# Altium schematic sheet cpu_board.SchDoc
size A3
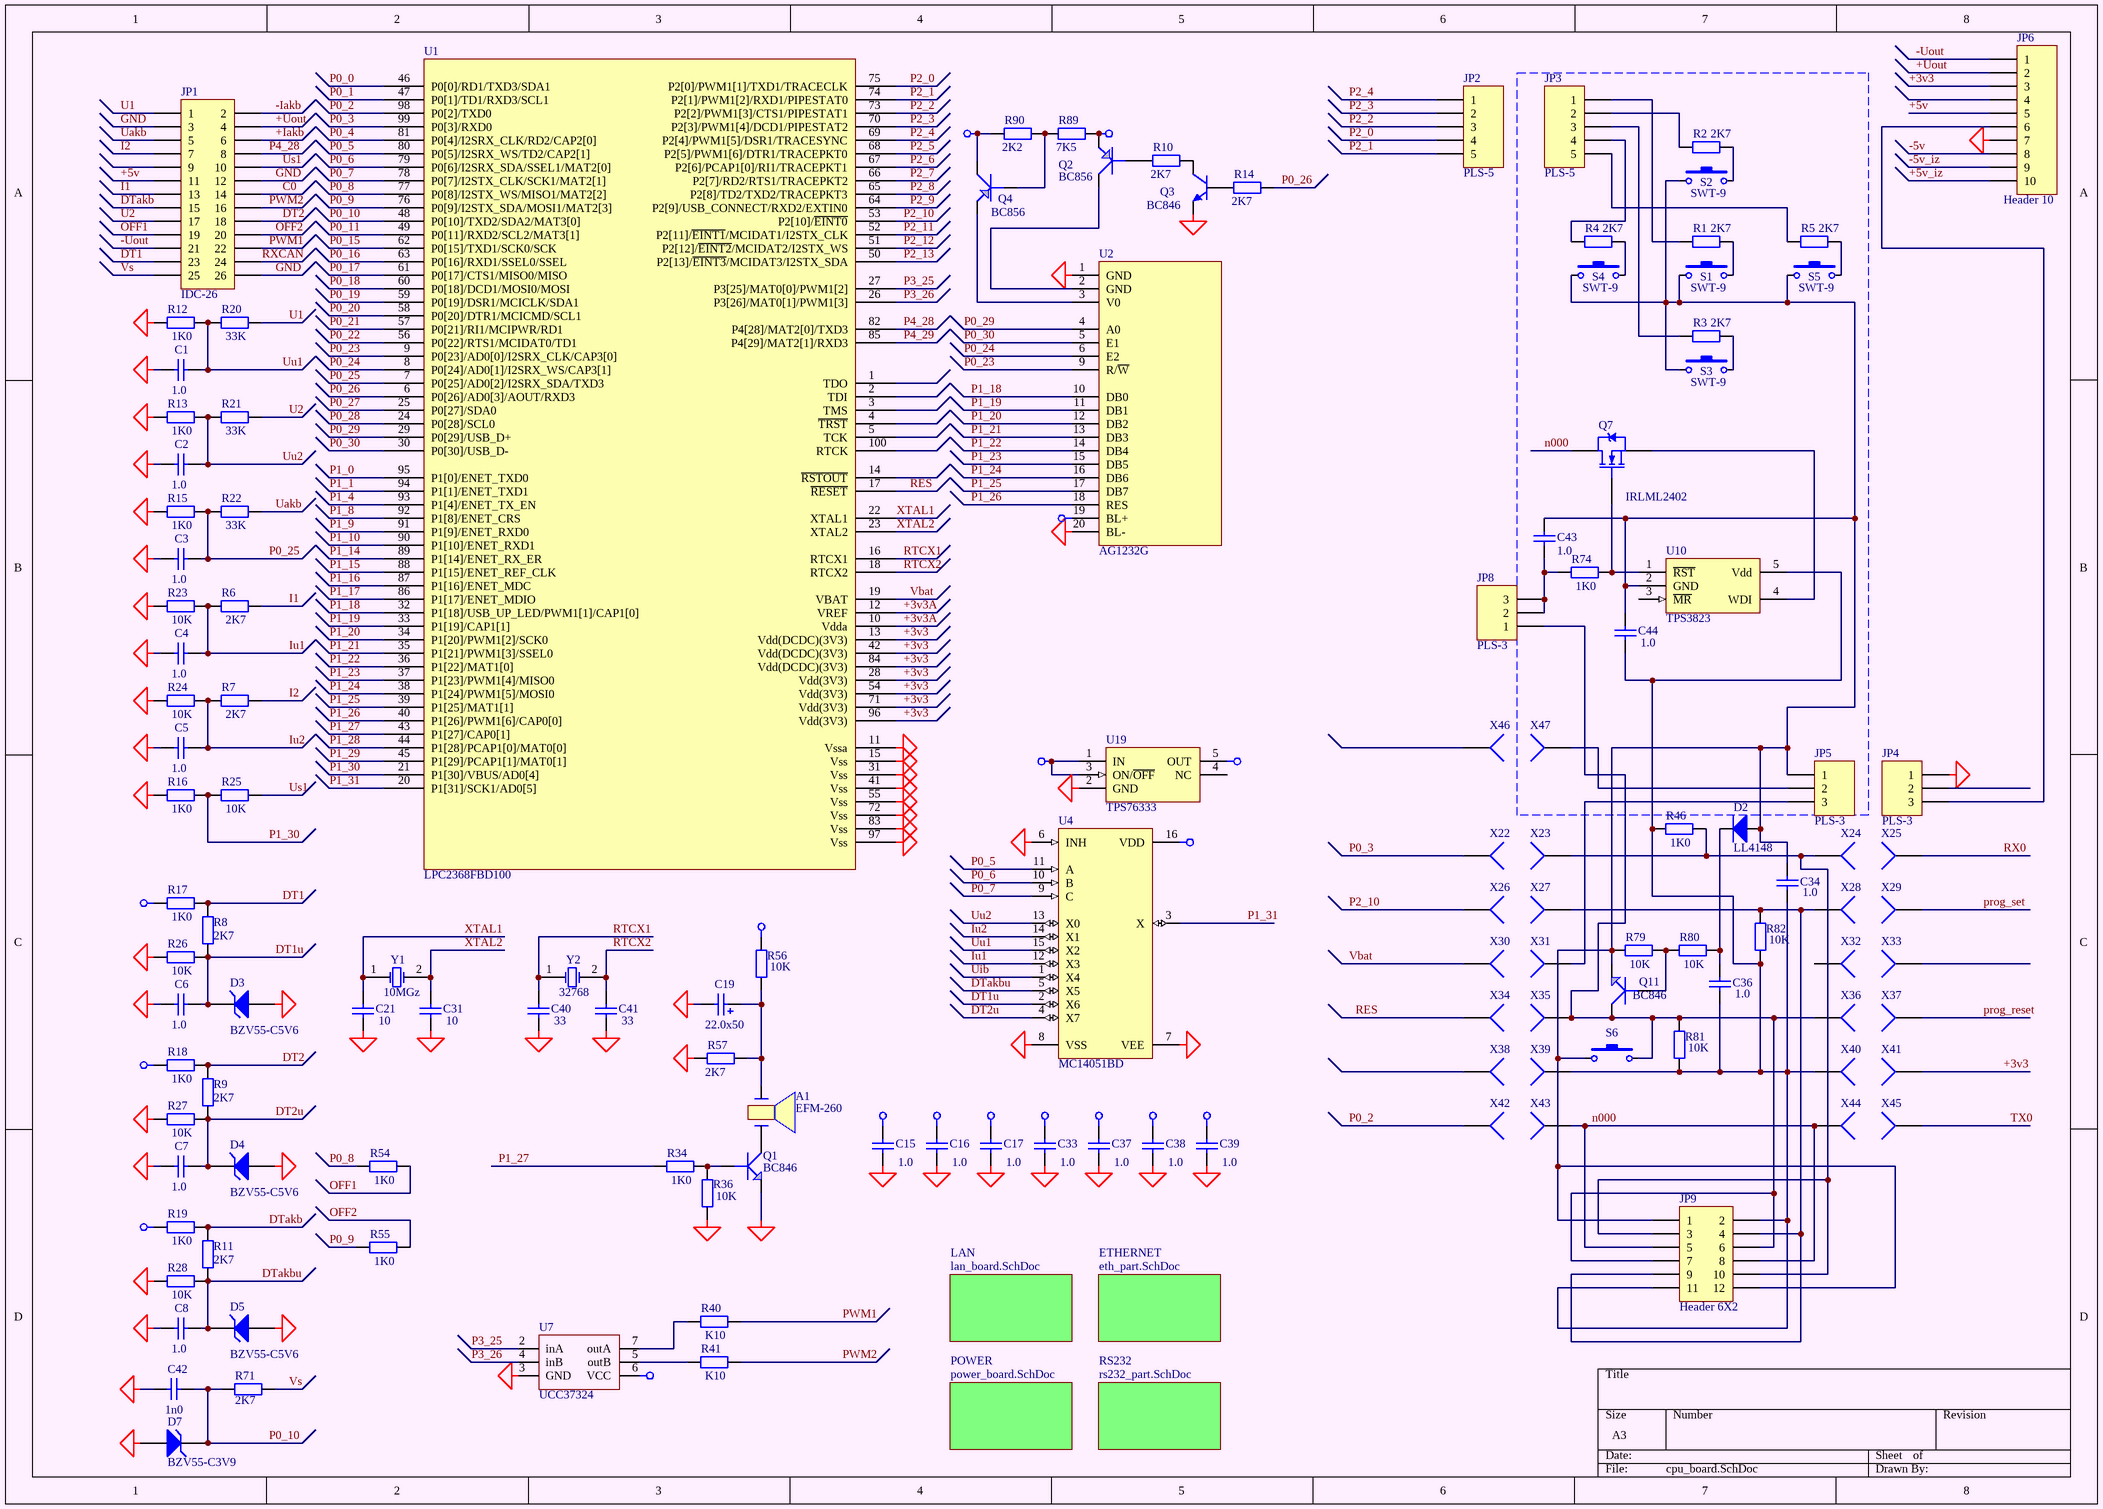
[diagram p0: cpu_board.SchDoc]

## Parts
A1  EFM-260  [Pjezo15]
C1  1.0  [C3216-1206]
C2  1.0  [C3216-1206]
C3  1.0  [C3216-1206]
C4  1.0  [C3216-1206]
C5  1.0  [C3216-1206]
C6  1.0  [C3216-1206]
C7  1.0  [C3216-1206]
C8  1.0  [_1206]
C15  1.0  [C3216-1206]
C16  1.0  [C3216-1206]
C17  1.0  [_1206]
C19  22.0x50  [el3]
C21  10  [_1206]
C31  10  [_1206]
C33  1.0  [_1206]
C34  1.0  [C3216-1206]
C36  1.0  [C3216-1206]
C37  1.0  [_1206]
C38  1.0  [_1206]
C39  1.0  [_1206]
C40  33  [_1206]
C41  33  [_1206]
C42  1n0  [_1206]
C43  1.0  [_1206]
C44  1.0  [_1206]
D2  LL4148  [_1206d]
D3  BZV55-C5V6  [_1206d]
D4  BZV55-C5V6  [_1206d]
D5  BZV55-C5V6  [_1206d]
D7  BZV55-C3V9  [_1206d]
JP1  IDC-26  [SCM-26]
JP2  PLS-5  [HDR1X5]
JP3  PLS-5  [HDR1X5]
JP4  PLS-3  [HDR1X3]
JP5  PLS-3  [HDR1X3]
JP6  Header 10  [HDR2X5]
JP8  PLS-3  [HDR1X3]
JP9  Header 6X2  [sl-12mini]
Q1  BC846  [SO-G3]
Q2  BC856  [SO-G3]
Q3  BC846  [SO-G3]
Q4  BC856  [SO-G3]
Q7  IRLML2402  [SO-G3]
Q11  BC846  [SO-G3]
R1  2K7  [_1206]
R2  2K7  [_1206]
R3  2K7  [_1206]
R4  2K7  [_1206]
R5  2K7  [_1206]
R6  2K7  [_1206]
R7  2K7  [_1206]
R8  2K7  [_1206]
R9  2K7  [_1206]
R10  2K7  [_1206]
R11  2K7  [_1206]
R12  1K0  [_1206]
R13  1K0  [_1206]
R14  2K7  [_1206]
R15  1K0  [_1206]
R16  1K0  [_1206]
R17  1K0  [_1206]
R18  1K0  [_1206]
R19  1K0  [_1206]
R20  33K  [_1206]
R21  33K  [_1206]
R22  33K  [_1206]
R23  10K  [_1206]
R24  10K  [_1206]
R25  10K  [_1206]
R26  10K  [_1206]
R27  10K  [_1206]
R28  10K  [_1206]
R34  1K0  [_1206]
R36  10K  [_1206]
R40  K10  [_1206]
R41  K10  [_1206]
R46  1K0  [_1206]
R54  1K0  [_1206]
R55  1K0  [_1206]
R56  10K  [_1206]
R57  2K7  [_1206]
R71  2K7  [_1206]
R74  1K0  [_1206]
R79  10K  [_1206]
R80  10K  [_1206]
R81  10K  [_1206]
R82  10K  [_1206]
R89  7K5  [_1206]
R90  2K2  [_1206]
S1  SWT-9  [SWT-9]
S2  SWT-9  [SWT-9]
S3  SWT-9  [SWT-9]
S4  SWT-9  [SWT-9]
S5  SWT-9  [SWT-9]
S6  SWT-6  [SWT-6]  (value not drawn)
U1  LPC2368FBD100  [LPC2368]
U2  AG1232G  [AG1232G]
U4  MC14051BD  [SO-G16/C5.85]
U7  UCC37324  [SO-G8]
U10  TPS3823  [SO-G5/P.95]
U19  TPS76333  [SO-G5/P.95]
X22  (no value)  [PIN1]
X23  (no value)  [PIN1]
X24  (no value)  [PIN1]
X25  (no value)  [PIN1]
X26  (no value)  [PIN1]
X27  (no value)  [PIN1]
X28  (no value)  [PIN1]
X29  (no value)  [PIN1]
X30  (no value)  [PIN1]
X31  (no value)  [PIN1]
X32  (no value)  [PIN1]
X33  (no value)  [PIN1]
X34  (no value)  [PIN1]
X35  (no value)  [PIN1]
X36  (no value)  [PIN1]
X37  (no value)  [PIN1]
X38  (no value)  [PIN1]
X39  (no value)  [PIN1]
X40  (no value)  [PIN1]
X41  (no value)  [PIN1]
X42  (no value)  [PIN1]
X43  (no value)  [PIN1]
X44  (no value)  [PIN1]
X45  (no value)  [PIN1]
X46  (no value)  [PIN1]
X47  (no value)  [PIN1]
Y1  10MGz  [QWARZ1]
Y2  32768  [QWARZ2]

## Sub-sheets
ETHERNET = eth_part.SchDoc: no entries
LAN = lan_board.SchDoc: no entries
POWER = power_board.SchDoc: no entries
RS232 = rs232_part.SchDoc: no entries

## Nets
+3v3: C37.2 C38.2 C39.2 JP6.3 U1.13(Vdd(DCDC)(3V3)) U1.28(Vdd(3V3)) U1.42(Vdd(DCDC)(3V3)) U1.54(Vdd(3V3)) U1.71(Vdd(3V3)) U1.84(Vdd(DCDC)(3V3)) U1.96(Vdd(3V3)) U4.16(VDD) X41.1
+3v3A: C17.2 C33.2 U1.10(Vdda) U1.12(VREF) U19.5(OUT)
+5v: C15.2 JP1.11 JP6.5 Q2.2(E) R17.2 R18.2 R19.2 R89.2 U2.19(BL+) U7.6(VCC) U19.1(IN) U19.3(ON/~{OFF})
+Uout: JP1.4 JP6.2 R56.2
-5v: C16.2 JP6.8 Q4.3(C) R90.1
GND: C1.2 C2.2 C3.2 C4.2 C5.2 C6.2 C7.2 C8.2 C15.1 C16.1 C17.1 C19.2 C21.1 C31.1 C33.1 C37.1 C38.1 C39.1 C40.1 C41.1 C42.2 D3.1(A) D4.1(A) D5.1(A) D7.1(A) JP1.3 JP1.12 JP1.26 JP4.1 JP6.7 Q1.2(E) Q3.2(E) R12.2 R13.2 R15.2 R16.2 R23.1 R24.1 R26.1 R27.1 R28.1 R36.1 R57.1 U1.11(Vssa) U1.15(Vss) U1.31(Vss) U1.41(Vss) U1.55(Vss) U1.72(Vss) U1.83(Vss) U1.97(Vss) U2.1(GND) U2.20(BL-) U4.6(INH) U4.7(VEE) U4.8(VSS) U7.3(GND) U19.2(GND)
+5v_iz: JP6.10
+Iakb: JP1.6
-5v_iz: JP6.9
-Iakb: JP1.2
-Uout: JP1.21 JP6.1
C0: JP1.14
DT1: JP1.23 R8.2 R17.1
DT1u: C6.1 D3.2(K) R8.1 R26.2 U4.2(X6)
DT2: JP1.18 R9.2 R18.1
DT2u: C7.1 D4.2(K) R9.1 R27.2 U4.4(X7)
DTakb: JP1.15 R11.2 R19.1
DTakbu: C8.1 D5.2(K) R11.1 R28.2 U4.5(X5)
I1: JP1.13 R6.2
I2: JP1.7 R7.2
Iu1: C4.1 R6.1 R23.2 U4.12(X3)
Iu2: C5.1 R7.1 R24.2 U4.14(X1)
n000: JP9.5 JP9.8 Q7.3(D) X43.1 X44.1
OFF1: JP1.19 R54.2
OFF2: JP1.20 R55.2
P0_0: U1.46(P0[0]/RD1/TXD3/SDA1)
P0_1: U1.47(P0[1]/TD1/RXD3/SCL1)
P0_2: U1.98(P0[2]/TXD0) X42.1
P0_3: U1.99(P0[3]/RXD0) X22.1
P0_4: U1.81(P0[4]/I2SRX_CLK/RD2/CAP2[0])
P0_5: U1.80(P0[5]/I2SRX_WS/TD2/CAP2[1]) U4.11(A)
P0_6: U1.79(P0[6]/I2SRX_SDA/SSEL1/MAT2[0]) U4.10(B)
P0_7: U1.78(P0[7]/I2STX_CLK/SCK1/MAT2[1]) U4.9(C)
P0_8: R54.1 U1.77(P0[8]/I2STX_WS/MISO1/MAT2[2])
P0_9: R55.1 U1.76(P0[9]/I2STX_SDA/MOSI1/MAT2[3])
P0_10: C42.1 D7.2(K) R71.2 U1.48(P0[10]/TXD2/SDA2/MAT3[0])
P0_11: U1.49(P0[11]/RXD2/SCL2/MAT3[1])
P0_15: U1.62(P0[15]/TXD1/SCK0/SCK)
P0_16: U1.63(P0[16]/RXD1/SSEL0/SSEL)
P0_17: U1.61(P0[17]/CTS1/MISO0/MISO)
P0_18: U1.60(P0[18]/DCD1/MOSI0/MOSI)
P0_19: U1.59(P0[19]/DSR1/MCICLK/SDA1)
P0_20: U1.58(P0[20]/DTR1/MCICMD/SCL1)
P0_21: U1.57(P0[21]/RI1/MCIPWR/RD1)
P0_22: U1.56(P0[22]/RTS1/MCIDAT0/TD1)
P0_23: U1.9(P0[23]/AD0[0]/I2SRX_CLK/CAP3[0]) U2.9(R/~{W})
P0_24: U1.8(P0[24]/AD0[1]/I2SRX_WS/CAP3[1]) U2.6(E2)
P0_25: C3.1 R15.1 R22.1 U1.7(P0[25]/AD0[2]/I2SRX_SDA/TXD3)
P0_26: R14.1 U1.6(P0[26]/AD0[3]/AOUT/RXD3)
P0_27: U1.25(P0[27]/SDA0)
P0_28: U1.24(P0[28]/SCL0)
P0_29: U1.29(P0[29]/USB_D+) U2.4(A0)
P0_30: U1.30(P0[30]/USB_D-) U2.5(E1)
P1_0: U1.95(P1[0]/ENET_TXD0)
P1_1: U1.94(P1[1]/ENET_TXD1)
P1_4: U1.93(P1[4]/ENET_TX_EN)
P1_8: U1.92(P1[8]/ENET_CRS)
P1_9: U1.91(P1[9]/ENET_RXD0)
P1_10: U1.90(P1[10]/ENET_RXD1)
P1_14: U1.89(P1[14]/ENET_RX_ER)
P1_15: U1.88(P1[15]/ENET_REF_CLK)
P1_16: U1.87(P1[16]/ENET_MDC)
P1_17: U1.86(P1[17]/ENET_MDIO)
P1_18: U1.32(P1[18]/USB_UP_LED/PWM1[1]/CAP1[0]) U2.10(DB0)
P1_19: U1.33(P1[19]/CAP1[1]) U2.11(DB1)
P1_20: U1.34(P1[20]/PWM1[2]/SCK0) U2.12(DB2)
P1_21: U1.35(P1[21]/PWM1[3]/SSEL0) U2.13(DB3)
P1_22: U1.36(P1[22]/MAT1[0]) U2.14(DB4)
P1_23: U1.37(P1[23]/PWM1[4]/MISO0) U2.15(DB5)
P1_24: U1.38(P1[24]/PWM1[5]/MOSI0) U2.16(DB6)
P1_25: U1.39(P1[25]/MAT1[1]) U2.17(DB7)
P1_26: U1.40(P1[26]/PWM1[6]/CAP0[0]) U2.18(RES)
P1_27: R34.1 U1.43(P1[27]/CAP0[1])
P1_28: U1.44(P1[28]/PCAP1[0]/MAT0[0])
P1_29: U1.45(P1[29]/PCAP1[1]/MAT0[1])
P1_30: R16.1 R25.1 U1.21(P1[30]/VBUS/AD0[4])
P1_31: U1.20(P1[31]/SCK1/AD0[5]) U4.3(X)
P2_0: JP2.4 U1.75(P2[0]/PWM1[1]/TXD1/TRACECLK)
P2_1: JP2.5 U1.74(P2[1]/PWM1[2]/RXD1/PIPESTAT0)
P2_2: JP2.3 U1.73(P2[2]/PWM1[3]/CTS1/PIPESTAT1)
P2_3: JP2.2 U1.70(P2[3]/PWM1[4]/DCD1/PIPESTAT2)
P2_4: JP2.1 U1.69(P2[4]/PWM1[5]/DSR1/TRACESYNC)
P2_5: U1.68(P2[5]/PWM1[6]/DTR1/TRACEPKT0)
P2_6: U1.67(P2[6]/PCAP1[0]/RI1/TRACEPKT1)
P2_7: U1.66(P2[7]/RD2/RTS1/TRACEPKT2)
P2_8: U1.65(P2[8]/TD2/TXD2/TRACEPKT3)
P2_9: U1.64(P2[9]/USB_CONNECT/RXD2/EXTIN0)
P2_10: U1.53(P2[10]/~{EINT0}) X26.1
P2_11: U1.52(P2[11]/~{EINT1}/MCIDAT1/I2STX_CLK)
P2_12: U1.51(P2[12]/~{EINT2}/MCIDAT2/I2STX_WS)
P2_13: U1.50(P2[13]/~{EINT3}/MCIDAT3/I2STX_SDA)
P3_25: U1.27(P3[25]/MAT0[0]/PWM1[2]) U7.2(inA)
P3_26: U1.26(P3[26]/MAT0[1]/PWM1[3]) U7.4(inB)
P4_28: JP1.8 U1.82(P4[28]/MAT2[0]/TXD3)
P4_29: U1.85(P4[29]/MAT2[1]/RXD3)
prog_reset: X37.1
prog_set: X29.1
PWM1: JP1.22 R40.1
PWM2: JP1.16 R41.1
RES: U1.17(~{RESET}) X34.1
RTCX1: C40.2 U1.16(RTCX1) Y2.1(OSC1)
RTCX2: C41.2 U1.18(RTCX2) Y2.2(OSC2)
RX0: X25.1
RXCAN: JP1.24
TX0: X45.1
U1: JP1.1 R20.2
U2: JP1.17 R21.2
Uakb: JP1.5 R22.2
Uib: U4.1(X4)
Us1: JP1.10 R25.2
Uu1: C1.1 R12.1 R20.1 U4.15(X2)
Uu2: C2.1 R13.1 R21.1 U4.13(X0)
Vbat: U1.19(VBAT) X30.1
Vs: JP1.25 R71.1
XTAL1: C21.2 U1.22(XTAL1) Y1.1(OSC1)
XTAL2: C31.2 U1.23(XTAL2) Y1.2(OSC2)
NetA1_1: A1.1 Q1.3(C)
NetA1_2: A1.2 C19.1 R56.1 R57.2
NetC34_1: C34.1 C43.1 C44.2 D2.1(A) JP5.1 JP9.1 JP9.12 Q11.2(E) R79.1 S1.1 S2.1 S3.1 S4.1 S5.1 S6.1 U10.2(GND)
NetC34_2: C34.2 C36.2 C44.1 JP9.2 JP9.11 R46.2 R81.1 R82.1 U10.5(Vdd) X39.1 X40.1
NetC36_1: C36.1 D2.2(K) R80.2
NetC43_2: C43.2 JP8.2 JP8.3 R74.2
NetJP3_1: JP3.1 R1.2
NetJP3_2: JP3.2 R2.2
NetJP3_3: JP3.3 R3.2
NetJP3_4: JP3.4 R4.2
NetJP3_5: JP3.5 R5.2
NetJP4_3: JP4.3 JP6.6
NetJP5_2: JP5.2 X47.1
NetJP5_3: JP5.3 X31.1
NetJP8_1: JP8.1 JP9.6 JP9.7 Q11.3(C) R81.2 S6.2 X35.1 X36.1
NetJP9_3: JP9.3 JP9.10 R46.1 X23.1 X24.1
NetJP9_4: JP9.4 JP9.9 R82.2 X27.1 X28.1
NetQ1_1: Q1.1(B) R34.2 R36.2
NetQ2_1: Q2.1(B) R10.2
NetQ2_3: Q2.3(C) U2.2(GND)
NetQ3_1: Q3.1(B) R14.2
NetQ3_3: Q3.3(C) R10.1
NetQ4_1: Q4.1(B) R89.1 R90.2
NetQ4_2: Q4.2(E) U2.3(V0)
NetQ7_1: Q7.1(G) R74.1 U10.1(~{RST})
NetQ7_2: Q7.2(S) U10.4(WDI)
NetQ11_1: Q11.1(B) R79.2 R80.1
NetR1_1: R1.1 S1.2
NetR2_1: R2.1 S2.2
NetR3_1: R3.1 S3.2
NetR4_1: R4.1 S4.2
NetR5_1: R5.1 S5.2
NetR40_2: R40.2 U7.7(outA)
NetR41_2: R41.2 U7.5(outB)

Not connected (* = marked no-connect by the designer): JP1 9; JP4 2; JP6 4; U1 1(TDO) 2(TDI) 3(TMS) 4(~{TRST}) 5(TCK) 14(~{RSTOUT}) 100(RTCK); U10 3(~{MR}); U19 4(NC); X32 1; X33 1; X38 1; X46 1

## Library data of the parts
A1 = PJEZ0
C1-C8 C34 C36 C42 = Cap Semi: Capacitor (Semiconductor SIM Model); Manufacturer: Generic Components; Class I: Passive; Value: 1,0; Published: 8-Jun-2000; Revision: July-2002: Re-released for DXP Platform.; Publisher: Altium Limited; Class II: Capacitor
C15-C17 C33 C37-C39 = Cap Semi: Capacitor (Semiconductor SIM Model); Manufacturer: Generic Components; Class I: Passive; Value: 0,1; Published: 8-Jun-2000; Revision: July-2002: Re-released for DXP Platform.; Publisher: Altium Limited; Class II: Capacitor
C19 = Cap Pol1: Polarized Capacitor (Radial); Manufacturer: Generic Components; Class I: Passive; Value: 22,0; Published: 8-Jun-2000; Revision: July-2002: Re-released for DXP Platform.; Publisher: Altium Limited; Class II: Capacitor
C21 C31 C40 C41 = Cap Semi: Capacitor (Semiconductor SIM Model); Manufacturer: Generic Components; Class I: Passive; Value: 15pF; Published: 8-Jun-2000; Revision: July-2002: Re-released for DXP Platform.; Publisher: Altium Limited; Class II: Capacitor
C43 C44 = Cap Semi: Capacitor; Manufacturer: Generic Components; Class I: Passive; Value: 0,1; Published: 8-Jun-2000; Revision: July-2002: Re-released for DXP Platform.; Publisher: Altium Limited; Class II: Capacitor
D2 = Diode: Default Diode; Manufacturer: Generic Components; Class I: Discrete; Class II: Diode - Switching; Published: 8-Jun-2000; Revision: July-2002: Re-released for DXP Platform.; Publisher: Altium Limited
D3-D5 D7 = D Zener: Zener Diode; Manufacturer: Generic Components; Class I: Discrete; Class II: Diode - Zener; Published: 8-Jun-2000; Revision: July-2002: Re-released for DXP Platform.; Publisher: Altium Limited
JP1 = MHDR2X13: Header, 13-Pin, Dual row; Manufacturer: Generic Components; Class I: Connector; Revision: July-2002: Re-released for DXP Platform.; Publisher: Altium Limited
JP2 JP3 = Header 5: Header, 5-Pin; Manufacturer: Generic Components; Class I: Connector; Revision: July-2002: Re-released for DXP Platform.; Publisher: Altium Limited
JP4 JP5 JP8 = Header 3: Header, 3-Pin; Manufacturer: Generic Components; Class I: Connector; Revision: July-2002: Re-released for DXP Platform.; Publisher: Altium Limited
JP6 = Header 10: Header, 10-Pin; Manufacturer: Generic Components; Class I: Connector; Revision: July-2002: Re-released for DXP Platform.; Publisher: Altium Limited
JP9 = Header 6X2: Header, 6-Pin, Dual row; Manufacturer: Generic Components; Class I: Connector; Revision: July-2002: Re-released for DXP Platform.; Publisher: Altium Limited
Q1 Q11 = GT122: Right: 20; Bottom: 20
Q2 Q4 = GT109: Right: 20; Bottom: 20
Q3 = BC847ALT1: General Purpose Transistor NPN Silicon; Manufacturer: Motorola; Package Information: Latest Revision: 1997; Class I: Discrete; Class II: BJT - Low Power; Published: 29-Sep-2000; Revision: July-2002: Re-released for DXP Platform.; Datasheet: Latest Revision: 1997; Package Reference: 318-08; Publisher: Altium Limited
Q7 = IRLML2402: HEXFET Power MOSFET; Manufacturer: International Rectifier; Class I: Discrete; Class II: MOSFET - Power; Published: 8-Jun-2000; Revision: July-2002: Re-released for DXP Platform.; Datasheet: Latest Revision: Aug-1997; Package Reference: SOT-23; Publisher: Altium Limited; Value: IRLML2402
R1-R9 R11 R20-R28 R34 R40 R41 R46 R54-R57 R71 R74 R79-R82 R89 R90 = Res2: Resistor; Manufacturer: Generic Components; Class I: Passive; Rule: Undefined; Published: 8-Jun-2000; Revision: July-2002: Re-released for DXP Platform.; Publisher: Altium Limited; Class II: Resistor
  R1-R9 R11 R57 R71: Value: 2K7
  R20-R22: Value: 33K
  R23-R28 R56 R79-R82: Value: 10K
  R34 R46 R54 R55 R74: Value: 1K0
  R40 R41: Value: K10
  R89: Value: 7K5
  R90: Value: 2K2
R10 R14 = Res2: Resistor; Manufacturer: Generic Components; Class I: Passive; Value: 1K0; Rule: Undefined; Published: 8-Jun-2000; Revision: July-2002: Re-released for DXP Platform.; Publisher: Altium Limited; Class II: Resistor
R12 R13 R15-R19 = Res2: Resistor; Manufacturer: Generic Components; Class I: Passive; Value: 1K; Rule: Undefined; Published: 8-Jun-2000; Revision: July-2002: Re-released for DXP Platform.; Publisher: Altium Limited; Class II: Resistor
R36 = Res2: Resistor; Manufacturer: Generic Components; Class I: Passive; Published: 8-Jun-2000; Revision: July-2002: Re-released for DXP Platform.; Publisher: Altium Limited; Class II: Resistor; Value: 10K
S1-S5 = SWT-9: Switch; Manufacturer: Generic Components; Published: 24-Mar-1999; Revision: July-2002: Re-released for DXP Platform.; Publisher: Altium Limited
S6 = SWT-9: Button; Manufacturer: Generic Components; Published: 24-Mar-1999; Revision: July-2002: Re-released for DXP Platform.; Publisher: Altium Limited; Value: SWT-6
U4 = MC14051BD: 8-Channel Analog Multiplexer/Demultiplexer; Manufacturer: ON Semiconductor; Class I: Logic; Class II: Multiplexer/Encoder/Selector; Published: 15-Apr-2002; Package Reference: 751B-05; Publisher: Altium Limited
U10 = TPS3823: Reset IC; Manufacturer: National Semiconductor; Package Information: Latest Revision: Aug-1999; Class I: Power Management; Class II: Voltage Regulator; Value: TPS76333; Published: 15-Apr-2002; Datasheet: Latest Revision: Oct-1999; Package Reference: MA05B; Publisher: Altium Limited
U19 = LP2980AIM5-3.3: Micropower SOT, 50 mA Ultra Low-Dropout Regulator; Manufacturer: National Semiconductor; Package Information: Latest Revision: Aug-1999; Class I: Power Management; Class II: Voltage Regulator; Published: 15-Apr-2002; Datasheet: Latest Revision: Oct-1999; Package Reference: MA05B; Publisher: Altium Limited
X22-X47 = Socket: Manufacturer: Generic Components; Class I: Connector; Revision: July-2002: Re-released for DXP Platform.; Publisher: Altium Limited
Y1 Y2 = XTAL: Crystal Oscillator; Manufacturer: Generic Components; Published: 8-Jun-2000; Revision: July-2002: Re-released for DXP Platform.; Publisher: Altium Limited; Class I: Oscillator; Class II: Crystal Oscillator